# EasyEDA Pro project ht系统板.epro

# Schematic Schematic1
Board Name: Board1; Create Date: 2025-05-16; Page Name: P1; Project Name: ht系统板; Schematic Name: Schematic1; Update Date: 2025-05-16; Company: 嘉立创EDA; Page Size: A4; Version: V1.0
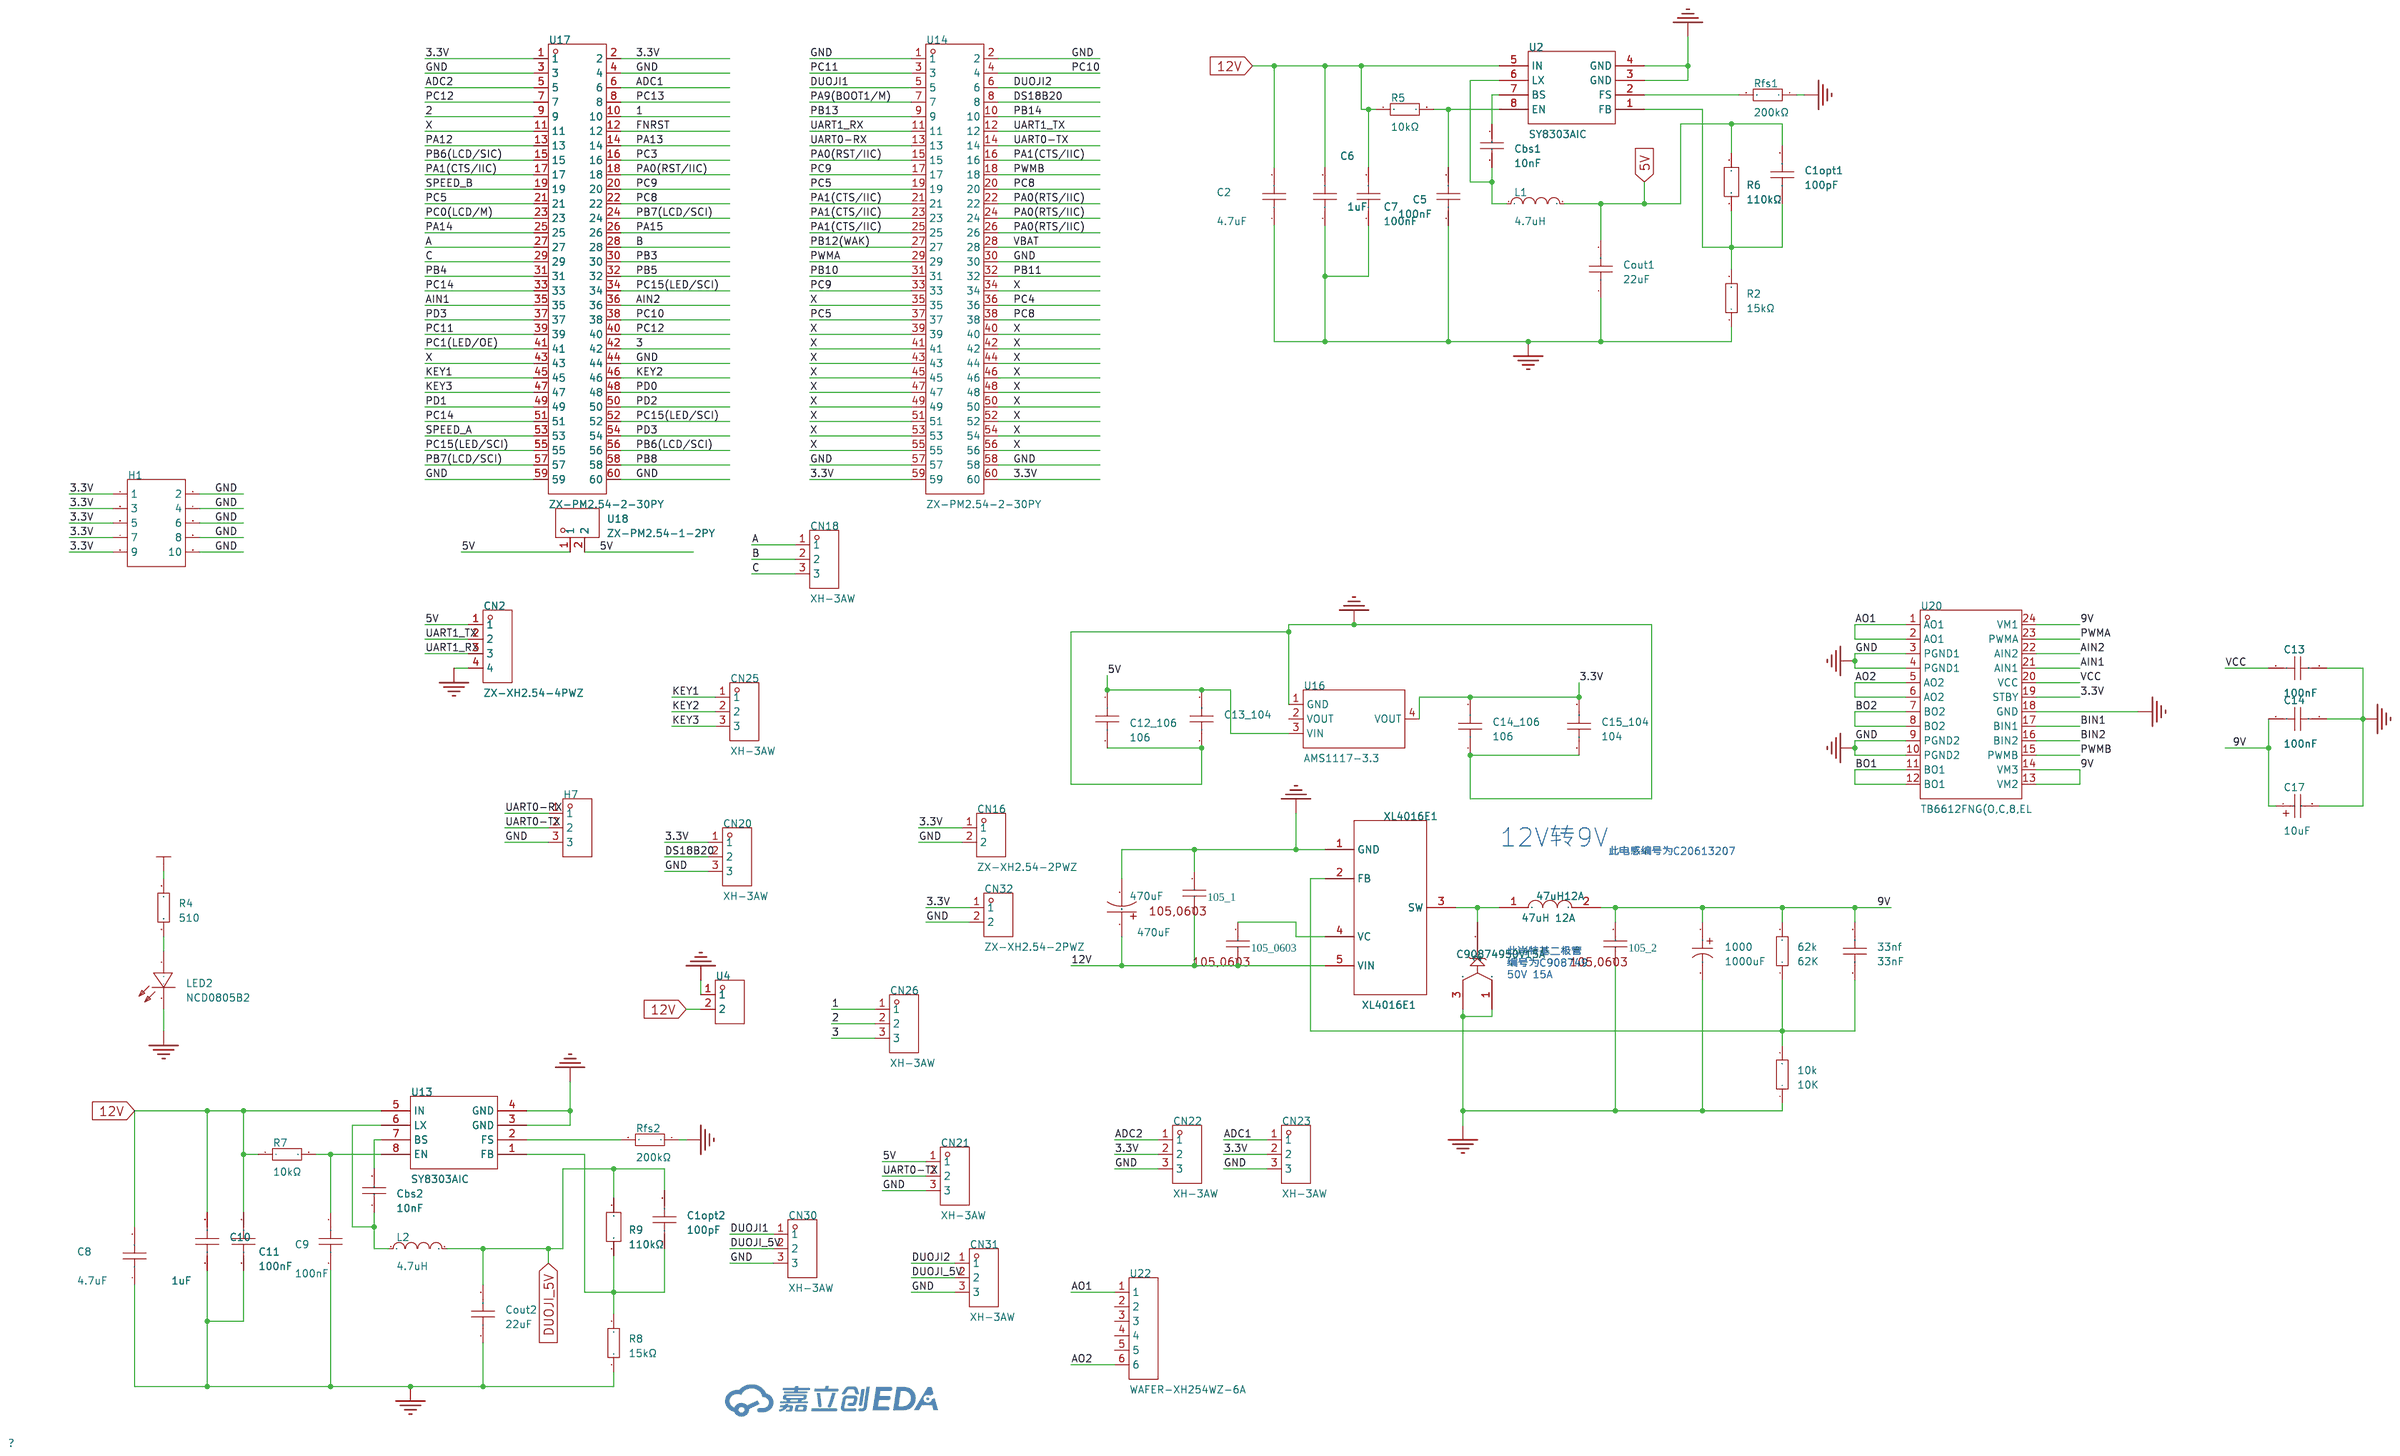
[diagram p0: schematic sheet]

## Parts
10k  10K  [r0805]
33nf  33nF  [C0603]
47uH12A  47uH 12A  [SMD,13.2x12.6mm]
62k  62K  [r0805]
105_1  105  [C0603]
105_2  105  [C0603]
105_0603  105  [C0603]
470uF  470uF  [CAP-SMD_BD12.5-L13.0-W13.0-RD]
1000  1000uF  [CAP-TH_BD10.0-P5.00-D1.0-FD]
C1opt1  100pF  [C0603]
C1opt2  100pF  [C0603]
C2  4.7uF  [C0402]
C5  100nF  [C0603]
C6  1uF  [C0603]
C7  100nF  [C0603]
C8  4.7uF  [C0402]
C9  100nF  [C0603]
C10  1uF  [C0603]
C11  100nF  [C0603]
C12_106  106  [C0603]
C13  100nF  [C0603]
C13_104  104  [C0603]
C14  100nF  [C0603]
C14_106  106  [C0603]
C15_104  104  [C0603]
C17  10uF  [CAP-SMD_L3.2-W1.6-RD-C7171]
C90874950V15A  -  [SL1550 50V 15A]
Cbs1  10nF  [C0603]
Cbs2  10nF  [C0603]
CN2  ZX-XH2.54-4PWZ  [CONN-TH_4P-P2.50_ZX-XH2.54-4PWZ]
CN16  ZX-XH2.54-2PWZ  [CONN-TH_2P-P2.50_ZX-XH2.54-2PWZ]
CN18  XH-3AW  [CONN-TH_3P-P2.54_HCTL_XH-3AW]
CN20  XH-3AW  [CONN-TH_3P-P2.54_HCTL_XH-3AW]
CN21  XH-3AW  [CONN-TH_3P-P2.54_HCTL_XH-3AW]
CN22  XH-3AW  [CONN-TH_3P-P2.54_HCTL_XH-3AW]
CN23  XH-3AW  [CONN-TH_3P-P2.54_HCTL_XH-3AW]
CN25  XH-3AW  [CONN-TH_3P-P2.54_HCTL_XH-3AW]
CN26  XH-3AW  [CONN-TH_3P-P2.54_HCTL_XH-3AW]
CN30  XH-3AW  [CONN-TH_3P-P2.54_HCTL_XH-3AW]
CN31  XH-3AW  [CONN-TH_3P-P2.54_HCTL_XH-3AW]
CN32  ZX-XH2.54-2PWZ  [CONN-TH_2P-P2.50_ZX-XH2.54-2PWZ]
Cout1  22uF  [C0805]
Cout2  22uF  [C0805]
H1  -  [HDR-TH_10P-P2.54-V-F-R2-C5-S2.54]
H7  -  [HDR-TH_3P-P2.54-V-M]
L1  4.7uH  [IND-SMD_L5.4-W5.2_FXL0530]
L2  4.7uH  [IND-SMD_L5.4-W5.2_FXL0530]
LED2  NCD0805B2  [LED0805-R-RD]
R2  15kΩ  [R0603]
R4  510  [R0603]
R5  10kΩ  [R0603]
R6  110kΩ  [R0603]
R7  10kΩ  [R0603]
R8  15kΩ  [R0603]
R9  110kΩ  [R0603]
Rfs1  200kΩ  [R0603]
Rfs2  200kΩ  [R0603]
U2  SY8303AIC  [TSOT-23-8_L2.9-W1.6-P0.65-LS2.8-BR]
U4  KF301-5.0-2P  [CONN-TH_P5.00_KF301-5.0-2P]
U13  SY8303AIC  [TSOT-23-8_L2.9-W1.6-P0.65-LS2.8-BR]
U14  ZX-PM2.54-2-30PY  [HDR-TH_60P-P2.54-V-F-R2-C30-S2.54]
U16  AMS1117-3.3  [SOT-223-3_L6.5-W3.4-P2.30-LS7.0-BR]
U17  ZX-PM2.54-2-30PY  [HDR-TH_60P-P2.54-V-F-R2-C30-S2.54]
U18  ZX-PM2.54-1-2PY  [HDR-TH_2P-P2.54-V-F]
U20  TB6612FNG(O,C,8,EL  [SSOP-24_L8.4-W5.8-P0.65-LS7.8-BL]
U22  WAFER-XH254WZ-6A  [CONN-TH_6P-P2.50_WAFER-XH254WZ-6A]
XL4016E1  XL4016E1  [TO-220-5L_L10.2-W4.5-P1.71-L]

## Library data of the parts
10k 62k R4 = Res_0603: Supplier Footprint: 0603
33nf C12_106 C13 C13_104 C14 C14_106 C15_104 = CAP_0603: Supplier Footprint: 0603
47uH12A = SMD,13.2x12.6mm
105_1 105_2 105_0603 = 105: Published: 8-Jun-2000; LatestRevisionDate: 17-Jul-2002; LatestRevisionNote: Re-released for DXP Platform.; Publisher: Altium Limited; Comment: 105,0603; Supplier: LCSC; Manufacturer: YAGEO; Manufacturer Part: CC0603KRX7R9BB104; Supplier Part: C14663
470uF = RVT1H471M1213: 容值:470uF;精度:±20%;额定电压:50V;纹波电流:530mA@120Hz;等效串联电阻:-;; LCSC Part Name: 470uF ±20% 50V; Supplier Part: C90272; Manufacturer: ROQANG(容强); Supplier Footprint: SMD,D12.5xL13.5mm; Datasheet: https://atta.szlcsc.com/upload/public/pdf/source/20220809/CF99377A6EA3F4895B6230BA7EE6A383.pdf; Supplier: LCSC; Tolerance: ±20%; Rated Voltage: 50V; Ripple Current: 530mA@120Hz; φD: 12.5mm; L: 13.5mm; Lifetime @ Temp: 2000hrs@105℃; Operating Temperature: -40℃~+105℃
1000 = SPE1EM102G12OL: 容值:1000uF;精度:±20%;额定电压:25V;纹波电流:-;等效串联电阻:-;类型:-;; LCSC Part Name: 1000uF ±20% 25V; Supplier Part: C697713; Manufacturer: Yunxing(云星); Supplier Footprint: 插件,D10xL12mm; JLCPCB Part Class: 扩展库; Datasheet: https://atta.szlcsc.com/upload/public/pdf/source/20200729/C697708_049AB0761557015E7F0CEB2EDBAAE750.pdf; Supplier: LCSC; Tolerance: ±20%; Rated Voltage: 25V; Lead Spacing: 5mm; φD: 10mm; L: 12mm; Lifetime @ Temp: 5000hrs@105℃; Operating Temperature: -55℃~+105℃
C1opt1 C1opt2 = CC0603JRNPO9BN101: 容值:100pF;精度:±5%;额定电压:50V;材质(温度系数):NP0;; LCSC Part Name: 100pF ±5% 50V; Supplier Part: C14665; Manufacturer: YAGEO(国巨); Supplier Footprint: 0603; JLCPCB Part Class: 扩展库; Datasheet: https://atta.szlcsc.com/upload/public/pdf/source/20181008/C309499_21CC21451B82C39E3D92150FD6B30293.pdf; Supplier: LCSC; Tolerance: ±5%; Voltage Rated: 50V; Temperature Coefficient: NP0
C2 C8 = CL05A475MQ5NRNC: 容值:4.7uF;精度:±20%;额定电压:6.3V;材质(温度系数):X5R;; LCSC Part Name: 4.7uF ±20% 6.3V; Supplier Part: C307423; Manufacturer: SAMSUNG(三星); Supplier Footprint: 0402; JLCPCB Part Class: 扩展库; Datasheet: https://atta.szlcsc.com/upload/public/pdf/source/20181010/C307423_0E0C4E35F3A09F81C2E5C84E00499E42.pdf; Supplier: LCSC; Tolerance: ±20%; Voltage Rated: 6.3V; Temperature Coefficient: X5R
C5 C7 C9 C11 = CGA0603X7R104K500JT: 容值:100nF;精度:±10%;额定电压:50V;材质(温度系数):X7R;; LCSC Part Name: 100nF ±10% 50V; Supplier Part: C6119867; Manufacturer: HRE(芯声); Supplier Footprint: 0603; JLCPCB Part Class: 扩展库; Supplier: LCSC; Tolerance: ±10%; Voltage Rated: 50V; Temperature Coefficient: X7R
C6 C10 = CGA0603X5R105K160JT: 容值:1uF;精度:±10%;额定电压:16V;材质(温度系数):X5R;; LCSC Part Name: 1uF ±10% 16V; Supplier Part: C6119849; Manufacturer: HRE(芯声); Supplier Footprint: 0603; JLCPCB Part Class: 扩展库; Supplier: LCSC; Tolerance: ±10%; Voltage Rated: 16V; Temperature Coefficient: X5R
C17 = TAJA106K016RNJ: 容值:10uF;精度:±10%;额定电压:16V;等效串联电阻(ESR):3Ω@100kHz;; LCSC Part Name: 10uF ±10% 16V; Supplier Part: C7171; Manufacturer: Kyocera AVX; Supplier Footprint: CASE-A-3216-18(mm); JLCPCB Part Class: 基础库; Supplier: LCSC; Tolerance: ±10%; Voltage Rating: 16V; Equivalent Series Resistance(ESR): 3Ω@100kHz; Operating Temperature: -55℃~+125℃
C90874950V15A = SL1550 50V 15A: 50V 15A; Supplier Part: C908749
Cbs1 Cbs2 = CC0603KRX7R9BB103: 容值:10nF;精度:±10%;额定电压:50V;材质(温度系数):X7R;; LCSC Part Name: 10nF ±10% 50V; Supplier Part: C100042; Manufacturer: YAGEO(国巨); Supplier Footprint: 0603; JLCPCB Part Class: 扩展库; Datasheet: https://atta.szlcsc.com/upload/public/pdf/source/20181008/C309510_22F155564471FAF6A489F7D68F34234E.pdf; Supplier: LCSC; Tolerance: ±10%; Voltage Rated: 50V; Temperature Coefficient: X7R
CN2 = ZX-XH2.54-4PWZ: 插针结构:1x4P;间距:2.5mm;安装方式:弯插;参考系列:XH;总PIN数:4P;排数:1;每排PIN数:4;行距:-;额定电流:3A;触头材质:黄铜;触头镀层:锡;工作温度范围:-25℃~+85℃;; LCSC Part Name: 1x4P 间距:2.5mm 弯插 系列:XH; Supplier Part: C7429643; Manufacturer: Megastar(兆星); Supplier Footprint: 弯插,P=2.5mm; JLCPCB Part Class: 扩展库; Datasheet: https://atta.szlcsc.com/upload/public/pdf/source/20230619/8DC602C7BA46C153FF1BE89D90453879.pdf; Supplier: LCSC; Pins Structure: 1x4P; Pitch: 2.5mm; Mounting Type: 弯插; Reference Series: XH; Number of Pins: 4P; Number of Rows: 1; Number of PINs Per Row: 4; Rated Current: 3A; Contact Material: 黄铜; Contact Plating: 锡; Operating Temperature: -25℃~+85℃; Rated Voltage (Max): 250V; Plastic Material: PA66; Flame Retardant Rating: UL94V-0; Color: 白色; Z-Height of the Board: 5.9mm; X-Length of Bottom Edge on Board (Spacing Line): 12.5mm; Y-Width of Bottom Edge on Board: 7.32mm
CN16 CN32 = ZX-XH2.54-2PWZ: 插针结构:1x2P;间距:2.5mm;安装方式:弯插;参考系列:XH;总PIN数:2P;排数:1;每排PIN数:2;行距:-;额定电流:3A;触头材质:黄铜;触头镀层:锡;工作温度范围:-25℃~+85℃;; LCSC Part Name: 1x2P 间距:2.5mm 弯插 系列:XH; Supplier Part: C7429641; Manufacturer: Megastar(兆星); Supplier Footprint: 弯插,P=2.5mm; JLCPCB Part Class: 扩展库; Datasheet: https://atta.szlcsc.com/upload/public/pdf/source/20230619/56AE8F2E01CDFEAA97FC89B5ED558AB5.pdf; Supplier: LCSC; Pins Structure: 1x2P; Pitch: 2.5mm; Mounting Type: 弯插; Reference Series: XH; Number of Pins: 2P; Number of Rows: 1; Number of PINs Per Row: 2; Rated Current: 3A; Contact Material: 黄铜; Contact Plating: 锡; Operating Temperature: -25℃~+85℃; Rated Voltage (Max): 250V; Plastic Material: PA66; Flame Retardant Rating: UL94V-0; Color: 白色; Z-Height of the Board: 5.9mm; X-Length of Bottom Edge on Board (Spacing Line): 7.5mm; Y-Width of Bottom Edge on Board: 7.32mm
CN18 CN20-CN23 CN25 CN26 CN30 CN31 = XH-3AW_C2908612: 插针结构:1x3P;间距:2.54mm;安装方式:弯插;参考系列:XH;总PIN数:3P;排数:1;每排PIN数:3;行距:-;额定电流:3A;触头材质:黄铜;触头镀层:锡;工作温度范围:-25℃~+85℃;; LCSC Part Name: 1x3P 间距:2.54mm 弯插 系列:XH; Supplier Part: C2908612; Manufacturer: HCTL(华灿天禄); Supplier Footprint: 弯插,P=2.5mm; JLCPCB Part Class: 扩展库; Datasheet: https://atta.szlcsc.com/upload/public/pdf/source/20230711/B565BAF3B11666EF6B81B3605408F2BD.pdf; Supplier: LCSC; Pins Structure: 1x3P; Pitch: 2.54mm; Mounting Style: 弯插; Reference Series: XH; Number of Pins: 3P; Number of Rows: 1; Number of PINs Per Row: 3; Current Rating (Max): 3A; Contact Material: 黄铜; Contact Plating: 锡; Operating Temperature Range: -25℃~+85℃
Cout1 Cout2 = CGA0805X5R226M350MT: 容值:22uF;精度:±20%;额定电压:35V;材质(温度系数):X5R;; LCSC Part Name: 22uF ±20% 35V; Supplier Part: C6119901; Manufacturer: HRE(芯声); Supplier Footprint: 0805; JLCPCB Part Class: 扩展库; Datasheet: https://atta.szlcsc.com/upload/public/pdf/source/20231129/D589D0CC4D260F7AC3A77E53B455CCB3.pdf; Supplier: LCSC; Tolerance: ±20%; Voltage Rated: 35V; Temperature Coefficient: X5R
H1 = HDR-F_2.54_2x5: Supplier Part: C92270; Supplier Footprint: 插件
H7 = HDR-M_2.54_1x3P: Supplier Part: C2937625; Supplier Footprint: 插件
L1 L2 = FXL0530-4R7-M: 电感值:4.7uH;精度:±20%;额定电流:4.5A;饱和电流(Isat):5A;类型:一体成型电感;; LCSC Part Name: 4.7uH ±20% 5A; Supplier Part: C177246; Manufacturer: cjiang(长江微电); Supplier Footprint: SMD,5.2x5.4mm; JLCPCB Part Class: 扩展库; Datasheet: https://atta.szlcsc.com/upload/public/pdf/source/20240426/3189EA8206330E2108542F9E34E540E7.pdf; Supplier: LCSC; Tolerance: ±20%; Rated Current: 4.5A; Saturation Current (Isat): 5A; DC Resistance (DCR): 60mΩ; Type: 一体成型电感
LED2 = NCD0805B2: 发光颜色:蓝色;正向电压(VF):2.5V~3.6V;功率:72mW;正向电流:2mA;主波长:468nm~478nm;透镜颜色:无色透明透镜;发光强度:20mcd~55mcd;发光角度:130°;工作温度:-30℃~+85℃;; Supplier Part: C84259; Manufacturer: 国星光电; Supplier Footprint: 0805; JLCPCB Part Class: 扩展库; Datasheet: https://atta.szlcsc.com/upload/public/pdf/source/20200820/C84259_E5AC6865415989C4C2C2831134BA3A23.pdf; Supplier: LCSC; Emitted Color: 蓝色; Forward Voltage (VF): 2.5V~3.6V; Power Dissipation: 72mW; Forward Current: 2mA; Dominant Wavelength: 468nm~478nm; Lens Color: 无色透明透镜; Luminous Intensity: 20mcd~55mcd; Viewing Angle: 130°; Operating Temperature: -30℃~+85℃
R2 R8 = 0603WAF1502T5E: 电阻类型:厚膜电阻;阻值:15kΩ;精度:±1%;功率:100mW;最大工作电压:75V;温度系数:±100ppm/℃;; LCSC Part Name: 15kΩ ±1% 100mW 厚膜电阻; Supplier Part: C22809; Manufacturer: UNI-ROYAL(厚声); Supplier Footprint: 0603; JLCPCB Part Class: 基础库; Datasheet: https://atta.szlcsc.com/upload/public/pdf/source/20200306/C422600_1E6D84923E4A46A82E41ADD87F860B5C.pdf; Supplier: LCSC; Type: 厚膜电阻; Tolerance: ±1%; Power(Watts): 100mW; Overload Voltage (Max): 75V; Temperature Coefficient: ±100ppm/℃; Operating Temperature Range: -55℃~+155℃
R5 R7 = 0603WAF1002T5E: 电阻类型:厚膜电阻;阻值:10kΩ;精度:±1%;功率:100mW;最大工作电压:75V;温度系数:±100ppm/℃;; LCSC Part Name: 厚膜电阻 10kΩ ±1% 100mW; Supplier Part: C25804; Manufacturer: UNI-ROYAL(厚声); Supplier Footprint: 0603; JLCPCB Part Class: 基础库; Datasheet: https://atta.szlcsc.com/upload/public/pdf/source/20200306/C422600_1E6D84923E4A46A82E41ADD87F860B5C.pdf; Supplier: LCSC; Type: 厚膜电阻; Tolerance: ±1%; Power(Watts): 100mW; Overload Voltage (Max): 75V; Temperature Coefficient: ±100ppm/℃; Operating Temperature Range: -55℃~+155℃
R6 R9 = FRC0603F1103TS: 电阻类型:厚膜电阻;阻值:110kΩ;精度:±1%;功率:100mW;最大工作电压:75V;温度系数:±100ppm/℃;; LCSC Part Name: 110kΩ ±1% 100mW 厚膜电阻; Supplier Part: C2906984; Manufacturer: FOJAN(富捷); Supplier Footprint: 0603; JLCPCB Part Class: 扩展库; Datasheet: https://atta.szlcsc.com/upload/public/pdf/source/20211221/925EC7D7225764EE0046F22065062C87.pdf; Supplier: LCSC; Type: 厚膜电阻; Tolerance: ±1%; Power(Watts): 100mW; Overload Voltage (Max): 75V; Temperature Coefficient: ±100ppm/℃; Operating Temperature Range: -55℃~+155℃
Rfs1 Rfs2 = 0603WAF2003T5E: 电阻类型:厚膜电阻;阻值:200kΩ;精度:±1%;功率:100mW;最大工作电压:75V;温度系数:±100ppm/℃;; LCSC Part Name: 200kΩ ±1% 100mW 厚膜电阻; Supplier Part: C25811; Manufacturer: UNI-ROYAL(厚声); Supplier Footprint: 0603; JLCPCB Part Class: 基础库; Datasheet: https://atta.szlcsc.com/upload/public/pdf/source/20200306/C422600_1E6D84923E4A46A82E41ADD87F860B5C.pdf; Supplier: LCSC; Type: 厚膜电阻; Tolerance: ±1%; Power(Watts): 100mW; Overload Voltage (Max): 75V; Temperature Coefficient: ±100ppm/℃; Operating Temperature Range: -55℃~+155℃
U2 U13 = SY8303AIC: 功能类型:降压型;输入电压:-;输出电流(最大值):-;; Supplier Part: C97054; Manufacturer: silergy(矽力杰); Supplier Footprint: TSOT-23-8; JLCPCB Part Class: 扩展库; Datasheet: https://atta.szlcsc.com/upload/public/pdf/source/20170308/1488958431714.pdf; Supplier: LCSC; Function: 降压型; Switch tube (built-in/external): 内置
U4 = KF301-5.0-2P: 结构:1x2P;间距:5mm;颜色:蓝色;安装方式:直插;额定电流:17A;额定电压:250V;排数:1;线规 - AWG:14~22;线规 - 平方毫米:1.5;每排PIN数:2;工作温度范围:-30℃~+120℃;; LCSC Part Name: 5mm 1x2P 排数:1 每排P数:2 直插; Supplier Part: C474881; Manufacturer: KEFA(科发); Supplier Footprint: 插件,P=5mm; JLCPCB Part Class: 扩展库; Datasheet: https://atta.szlcsc.com/upload/public/pdf/source/20230317/03A5B5FC229D6F9225E8F51DA1A4E80A.pdf; Supplier: LCSC; Structure: 1x2P; Pitch: 5mm; Color: 蓝色; Mounting Style: 直插; Current Rating (Max): 17A; Voltage Rating (Max): 250V; Number of Pins: 2P; Number of Rows: 1; Wire Gauge - AWG: 14~22; Wire Gauge - mm2: 1.5; Number of PINs Per Row: 2; Operating Temperature Range: -30℃~+120℃
U14 U17 = ZX-PM2.54-2-30PY: 插孔结构:2x30P;间距:2.54mm;行距:2.54mm;圆孔/方孔:方孔;安装类型:直插;排数:双排;总孔位数:60P;额定电流:-;额定电压:1kV;插孔方向:顶部;塑高:8.5mm;触头材质:-;触头镀层:金;工作温度范围:-40℃~+105℃;焊接温度(最大值):260℃@5S;; LCSC Part Name: 2x30P 间距:2.54mm 直插; Supplier Part: C7499356; Manufacturer: Megastar(兆星); Supplier Footprint: 插件,P=2.54mm; JLCPCB Part Class: 扩展库; Datasheet: https://atta.szlcsc.com/upload/public/pdf/source/20231122/23E1107B34356833C267F6B6E856DE02.pdf; Supplier: LCSC; Holes Structure: 2x30P; Pitch: 2.54mm; Row Spacing: 2.54mm; Circular Hole / Square Hole: 方孔; Mounting Type: 直插; Number of Rows: 双排; Number of Holes: 60P; Voltage Rating (Max): 1kV; Holes Direction: 顶部; Insulation Height: 8.5mm; Contact Plating: 金; Operating Temperature Range: -40℃~+105℃; Soldering Temperature(Max): 260℃@5S
U16 = AMS1117-3.3_C6186: 输出类型:固定;工作电压:-;输出电压:3.3V;输出电流:1A;电源纹波抑制比(PSRR):72dB@(120Hz);输出极性:正极;; LCSC Part Name: 输出3.3V 1A; Supplier Part: C6186; Manufacturer: AMS; Supplier Footprint: SOT-223; JLCPCB Part Class: 基础库; Datasheet: https://atta.szlcsc.com/upload/public/pdf/source/20180727/C6186_7A095716F0823C02F1997A905E26C086.pdf; Supplier: LCSC; Output Type: 固定; Output Voltage: 3.3V; Output Current: 1A; Power Supply Rejection Ratio (PSRR): 72dB@(120Hz); Voltage Dropout: 1.3V@(800mA); Features: 过流保护(OCP)；热关断(TSD); Output Configuration: 正极; Number of Outputs: 1
U18 = ZX-PM2.54-1-2PY: 插孔结构:1x2P;间距:2.54mm;行距:-;圆孔/方孔:方孔;安装类型:直插;排数:单排;总孔位数:2P;额定电流:-;额定电压:1kV;插孔方向:顶部;塑高:8.5mm;触头材质:-;触头镀层:金;工作温度范围:-40℃~+105℃;焊接温度(最大值):260℃@5S;; LCSC Part Name: 1x2P 间距:2.54mm 直插; Supplier Part: C7499322; Manufacturer: Megastar(兆星); Supplier Footprint: 插件,P=2.54mm; JLCPCB Part Class: 扩展库; Datasheet: https://atta.szlcsc.com/upload/public/pdf/source/20231122/F22175ABE3DCBFEB9E36A2E7DA44623C.pdf; Supplier: LCSC; Holes Structure: 1x2P; Pitch: 2.54mm; Circular Hole / Square Hole: 方孔; Mounting Type: 直插; Number of Rows: 单排; Number of Holes: 2P; Voltage Rating (Max): 1kV; Holes Direction: 顶部; Insulation Height: 8.5mm; Contact Plating: 金; Operating Temperature Range: -40℃~+105℃; Soldering Temperature(Max): 260℃@5S
U20 = TB6612FNG(O,C,8,EL: 双直流电机驱动器集成电路; Supplier Part: C88224; Manufacturer: TOSHIBA(东芝); Supplier Footprint: SSOP-24-208mil; JLCPCB Part Class: 扩展库; Datasheet: https://atta.szlcsc.com/upload/public/pdf/source/20171128/C141517_15118625624231147036.pdf; Supplier: LCSC
U22 = WAFER-XH254WZ-6A: 插针结构:1x6P;间距:2.54mm;安装方式:弯插;参考系列:XH;总PIN数:6P;排数:1;每排PIN数:6;额定电流:3A;触头材质:黄铜;工作温度:-25℃~+85℃;; LCSC Part Name: 1x6P 间距:2.54mm 弯插 系列:XH; Supplier Part: C7432695; Manufacturer: HANBO(汉博); Supplier Footprint: 插件,P=2.5mm; JLCPCB Part Class: 扩展库; Datasheet: https://atta.szlcsc.com/upload/public/pdf/source/20230721/127D646758C1D4B76FEF9901992220E1.pdf; Supplier: LCSC; Pins Structure: 1x6P; Pitch: 2.54mm; Mounting Type: 弯插; Reference Series: XH; Number of Pins: 6P; Number of Rows: 1; Number of PINs Per Row: 6; Current Rating: 3A; Contact Material: 黄铜; Operating Temperature: -25℃~+85℃; Voltage Rating: 250V; Plastic Material: PA66; Flame Retardant Rating: UL94V-0
XL4016E1 = XL4016E1: 功能类型:降压型;输入电压:8V~40V;输出电压:1.25V~36V;输出电流(最大值):8A;; Supplier Part: C55881; Manufacturer: XLSEMI(芯龙); Supplier Footprint: TO-220-5; Datasheet: https://atta.szlcsc.com/upload/public/pdf/source/20221017/BA256A5392B705775B4C335FAFB3EDCF.pdf; Supplier: LCSC; Function: 降压型; Input Voltage: 8V~40V; Output Voltage: 1.25V~36V; Output Current (Max): 8A; Switching Frequency: 180kHz; Synchronous Rectification: 否; Number of Outputs: 1; Topology: 降压式; Switch tube (built-in/external): 内置

## Nets
3.3V: C14_106.2 C15_104.2 CN16.1 CN20.1 CN22.2 CN23.2 CN32.1 H1.1 H1.3 H1.5 H1.7 H1.9 R4.1 U14.59 U14.60 U16.4(VOUT) U17.1 U17.2 U20.19(STBY)
5V: C1opt1.2 C12_106.1 C13_104.2 CN2.1 CN21.1 Cout1.2 L1.2 R6.2 U16.3(VIN) U18.1 U18.2
9V: 33nf.2 47uH12A.2 62k.2 105_2.2 1000.1 C14.1 C17.1 U20.13(VM2) U20.14(VM3) U20.24(VM1)
12V: 105_1.1 105_0603.1 470uF.1 C2.2 C6.2 C7.2 C8.2 C10.2 C11.2 R5.1 R7.1 U2.5(IN) U4.2 U13.5(IN) XL4016E1.5(VIN)
GND: 10k.1 105_1.2 105_2.1 470uF.2 1000.2 C2.1 C5.1 C6.1 C7.1 C8.1 C9.1 C10.1 C11.1 C12_106.2 C13.2 C13_104.1 C14.2 C14_106.1 C15_104.1 C17.2 C90874950V15A.1 C90874950V15A.3 CN2.4 CN16.2 CN20.3 CN21.3 CN22.3 CN23.3 CN30.3 CN31.3 CN32.2 Cout1.1 Cout2.1 H1.2 H1.4 H1.6 H1.8 H1.10 H7.3 LED2.2(-) R2.1 R8.1 Rfs1.1 Rfs2.1 U2.3(GND) U2.4(GND) U4.1 U13.3(GND) U13.4(GND) U14.1 U14.2 U14.30 U14.57 U14.58 U16.1(GND) U17.3 U17.4 U17.44 U17.59 U17.60 U20.3(PGND1) U20.4(PGND1) U20.9(PGND2) U20.10(PGND2) U20.18(GND) XL4016E1.1(GND)
VBAT: U14.28
VCC: C13.1 U20.20(VCC)
1: CN26.1 U17.10
2: CN26.2 U17.9
3: CN26.3 U17.42
A: CN18.1 U17.27
ADC1: CN23.1 U17.6
ADC2: CN22.1 U17.5
AIN1: U17.35 U20.21(AIN1)
AIN2: U17.36 U20.22(AIN2)
AO1: U20.1(AO1) U20.2(AO1) U22.1
AO2: U20.5(AO2) U20.6(AO2) U22.6
B: CN18.2 U17.28
BIN1: U20.17(BIN1)
BIN2: U20.16(BIN2)
BO1: U20.11(BO1) U20.12(BO1)
BO2: U20.7(BO2) U20.8(BO2)
C: CN18.3 U17.29
DS18B20: CN20.2 U14.8
DUOJI1: CN30.1 U14.5
DUOJI2: CN31.1 U14.6
DUOJI_5V: C1opt2.2 CN30.2 CN31.2 Cout2.2 L2.2 R9.2
FNRST: U17.12
KEY1: CN25.1 U17.45
KEY2: CN25.2 U17.46
KEY3: CN25.3 U17.47
PA0(RST/IIC): U14.15 U17.18
PA0(RTS/IIC): U14.22 U14.24 U14.26
PA1(CTS/IIC): U14.16 U14.21 U14.23 U14.25 U17.17
PA9(BOOT1/M): U14.7
PA12: U17.13
PA13: U17.14
PA14: U17.25
PA15: U17.26
PB3: U17.30
PB4: U17.31
PB5: U17.32
PB6(LCD/SCI): U17.56
PB6(LCD/SIC): U17.15
PB7(LCD/SCI): U17.24 U17.57
PB8: U17.58
PB10: U14.31
PB11: U14.32
PB12(WAK): U14.27
PB13: U14.9
PB14: U14.10
PC0(LCD/M): U17.23
PC1(LED/OE): U17.41
PC3: U17.16
PC4: U14.36
PC5: U14.19 U14.37 U17.21
PC8: U14.20 U14.38 U17.22
PC9: U14.17 U14.33 U17.20
PC10: U14.4 U17.38
PC11: U14.3 U17.39
PC12: U17.7 U17.40
PC13: U17.8
PC14: U17.33 U17.51
PC15(LED/SCI): U17.34 U17.52 U17.55
PD0: U17.48
PD1: U17.49
PD2: U17.50
PD3: U17.37 U17.54
PWMA: U14.29 U20.23(PWMA)
PWMB: U14.18 U20.15(PWMB)
SPEED_A: U17.53
SPEED_B: U17.19
UART0-RX: H7.1 U14.13
UART0-TX: CN21.2 H7.2 U14.14
UART1_RX: CN2.3 U14.11
UART1_TX: CN2.2 U14.12
X: U14.34 U14.35 U14.39 U14.40 U14.41 U14.42 U14.43 U14.44 U14.45 U14.46 U14.47 U14.48 U14.49 U14.50 U14.51 U14.52 U14.53 U14.54 U14.55 U14.56 U17.11 U17.43
$1N2977: LED2.1(+) R4.2
$1N10374: C1opt1.1 R2.2 R6.1 U2.1(FB)
$1N10379: Cbs1.1 L1.1 U2.6(LX)
$1N10381: C5.2 R5.2 U2.8(EN)
$1N10383: Cbs1.2 U2.7(BS)
$1N10384: Rfs1.2 U2.2(FS)
$1N11084: Rfs2.2 U13.2(FS)
$1N11085: C9.2 R7.2 U13.8(EN)
$1N11090: Cbs2.1 L2.1 U13.6(LX)
$1N11091: Cbs2.2 U13.7(BS)
$1N11095: C1opt2.1 R8.2 R9.1 U13.1(FB)
$1N43238: 105_0603.2 XL4016E1.4(VC)
$1N43241: 10k.2 33nf.1 62k.1 XL4016E1.2(FB)
$1N43244: 47uH12A.1 C90874950V15A.2 XL4016E1.3(SW)

Not connected (* = marked no-connect by the designer): U16 2(VOUT); U22 2 3 4 5

## Notes on the sheet
- 12V转9V
- 此电感编号为C20613207
- 此肖特基二极管
  编号为C908749
  50V 15A

# Schematic Schematic2
Company: 嘉立创EDA; Page Size: A4; Version: V1.0
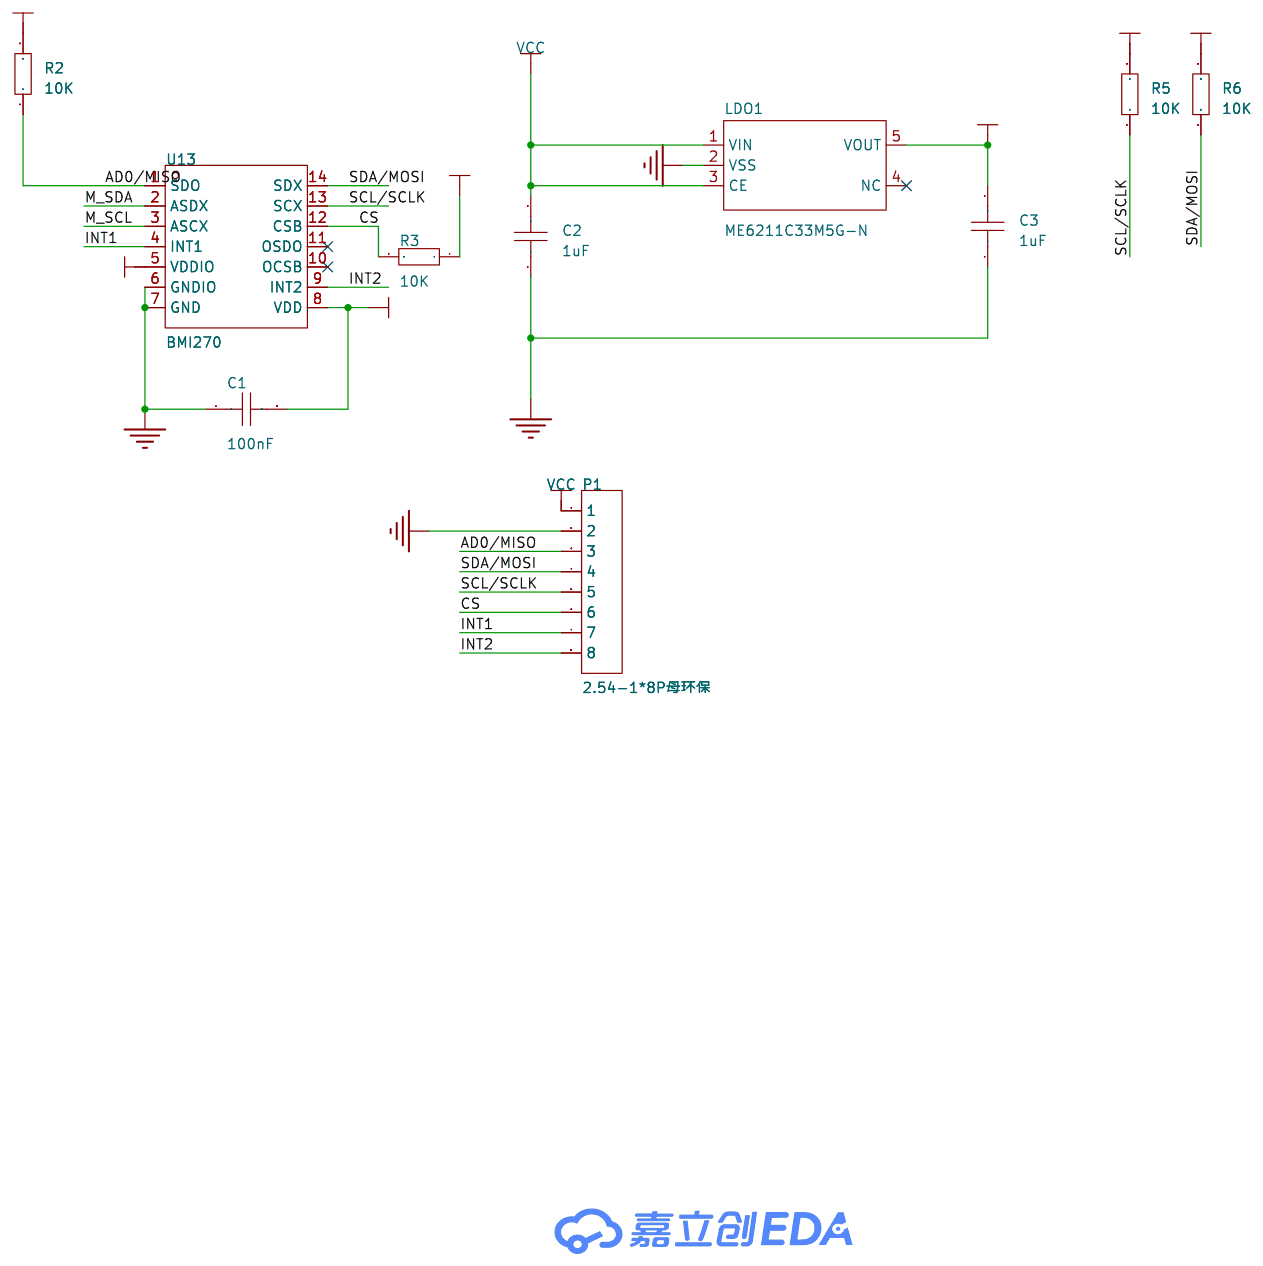
[diagram p1: schematic sheet]

## Parts
C1  100nF  [C0603]
C2  1uF  [C0603]
C3  1uF  [C0603]
LDO1  ME6211C33M5G-N  [SOT-23-5_L3.0-W1.7-P0.95-LS2.8-BL]
P1  2.54-1*8P母环保  [HDR-TH_8P-P2.54-V-F-1]
R2  10K  [R0603]
R3  10K  [R0603]
R5  10K  [R0603]
R6  10K  [R0603]
U13  BMI270  [LGA-14_L3.0-W2.5-P0.50-BR]

## Library data of the parts
C1-C3 = CAP_0603: Supplier Footprint: 0603
LDO1 = ME6211C33M5G-N: 输出类型:固定;工作电压:6V;输出电压:3.3V;输出电流:500mA;电源纹波抑制比(PSRR):70dB@(1kHz)；62dB@(10kHz);输出极性:正极;; LCSC Part Name: 输入6V 输出3.3V 500mA; Supplier Part: C82942; Manufacturer: MICRONE(南京微盟); Supplier Footprint: SOT-23-5; JLCPCB Part Class: 扩展库; Datasheet: https://atta.szlcsc.com/upload/public/pdf/source/20170918/C82942_1505727073070976520.pdf; Supplier: LCSC; Output Type: 固定; Voltage - Supply: 6V; Output Voltage: 3.3V; Output Current: 500mA; Power Supply Rejection Ratio (PSRR): 70dB@(1kHz)；62dB@(10kHz); Voltage Dropout: 260mV@(200mA); Features: 短路保护(SCP)；低ESR；过流保护(OCP)；带使能; Output Configuration: 正极; Number of Outputs: 1
P1 = 2.54-1*8P母环保: 插孔结构:1x8P;间距:2.54mm;行距:-;安装类型:直插;排数:单排;总孔位数:8P;塑高:-;触头材质:-;触头镀层:-;; LCSC Part Name: 间距:2.54mm 1x8P 直插; Supplier Part: C27438; Manufacturer: BOOMELE(博穆精密); Supplier Footprint: 插件,P=2.54mm; JLCPCB Part Class: 扩展库; Datasheet: https://atta.szlcsc.com/upload/public/pdf/source/20231221/1CA800C6799ED97958773716FAA1BFFE.pdf; Supplier: LCSC; Holes Structure: 1x8P; Pitch: 2.54mm; Mounting Type: 直插; Number of Rows: 单排; Number of Holes: 8P
R2 R3 R5 R6 = Res_0603: Supplier Footprint: 0603
U13 = BMI270: 传感器类型:加速度计陀螺仪;; Supplier Part: C2836813; Manufacturer: Bosch(博世); Supplier Footprint: LGA-14(2.5x3); JLCPCB Part Class: 扩展库; Datasheet: https://atta.szlcsc.com/upload/public/pdf/source/20210625/C2836813_35E1F3F92097F45A3828DF13DDBA01A5.pdf; Supplier: LCSC; Sensor Type: 加速度计陀螺仪; Operating Temperature: -40℃~+85℃

## Nets
3.3V: C1.2 C3.2 LDO1.5(VOUT) R2.2 R3.1 R5.1 R6.1 U13.5(VDDIO) U13.8(VDD)
GND: C1.1 C2.1 C3.1 LDO1.2(VSS) P1.2 U13.6(GNDIO) U13.7(GND)
VCC: C2.2 LDO1.1(VIN) LDO1.3(CE) P1.1
AD0/MISO: P1.3 R2.1 U13.1(SDO)
CS: P1.6 R3.2 U13.12(CSB)
INT1: P1.7 U13.4(INT1)
INT2: P1.8 U13.9(INT2)
M_SCL: U13.3(ASCX)
M_SDA: U13.2(ASDX)
SCL/SCLK: P1.5 R5.2 U13.13(SCX)
SDA/MOSI: P1.4 R6.2 U13.14(SDX)

Not connected (* = marked no-connect by the designer): LDO1 4(NC)*; U13 10(OCSB)* 11(OSDO)*

# Board PCB1
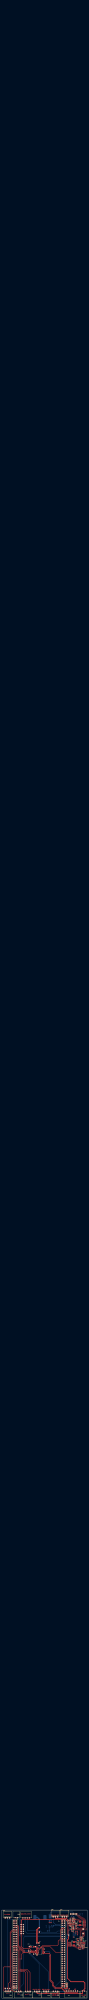
[diagram p2: board, top side]
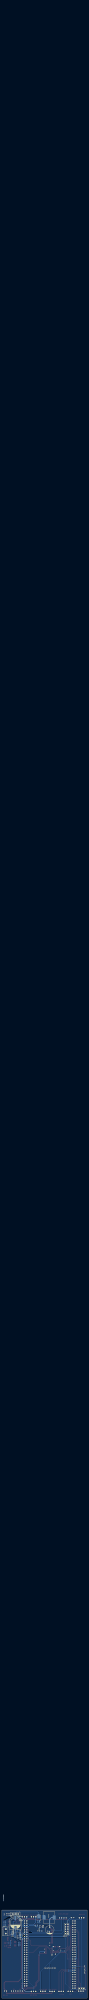
[diagram p3: board, bottom side, seen from below]

Outline 98 x 100 mm; copper layers: Top Layer, GND, 5V, Bottom Layer. Coordinates in mm from the lower left corner of the outline.
Outline path: rectangle 0,100 98,0
Stack: Top Layer 0.035mm 外层铜厚1oz / Dielectric1 0.2104mm 7628 RC49% 8.6mil / GND 0.0152mm 内层铜厚 / Dielectric2 1.065mm 1.1mm H/HOZ Copper / 5V 0.0152mm 内层铜厚 / Dielectric3 0.2104mm 7628 RC49% 8.6mil / Bottom Layer 0.035mm 外层铜厚1oz

## Design rules (mm)
template: JLCPCB Capability(Two Layers Board)
spacing copperThickness1oz (default): track to track 0.102, other pairs 0.152 to 0.3
spacing copperThickness2oz: track to track 0.203, other pairs 0.152 to 0.3
track width copperThickness1oz (default): min 0.127, default 0.254, max 2.54
track width copperThickness2oz: min 0.203, default 0.254, max 2.54
differential pair differentialPair (default): width min 0.127, default 0.254, max 2.54; gap min 0.152, default 0.152
via viaSize (default): diameter min 0.5, default 0.61, max 10; hole min 0.3, default 0.305, max 6.3

## Placement (name value [footprint] x y rotation side)
10k  10K  [r0805]  53.35 76.31 0 bottom
33nf  33nF  [C0603]  54.32 81.52 90 bottom
47uH12A  47uH 12A  [SMD,13.2x12.6mm]  43.72 91.62 180 bottom
62k  62K  [r0805]  58.32 82.47 180 bottom
105_1  105  [C0603]  92.23 95.17 270 bottom
105_2  105  [C0603]  50.96 81.47 90 bottom
105_0603  105  [C0603]  89.69 95.17 270 bottom
470uF  470uF  [CAP-SMD_BD12.5-L13.0-W13.0-RD]  82.33 84.89 90 bottom
1000  1000uF  [CAP-TH_BD10.0-P5.00-D1.0-FD]  43.09 77.65 270 bottom
C1opt1  100pF  [C0603]  94.47 59.17 270 top
C1opt2  100pF  [C0603]  77.56 87.38 90 top
C2  4.7uF  [C0402]  90.85 65.59 180 top
C5  100nF  [C0603]  90.03 59.72 180 top
C6  1uF  [C0603]  90.82 67.33 180 top
C7  100nF  [C0603]  90.86 69.14 180 top
C8  4.7uF  [C0402]  81.52 81.6 0 top
C9  100nF  [C0603]  82.16 87.23 0 top
C10  1uF  [C0603]  81.36 79.92 0 top
C11  100nF  [C0603]  81.36 77.92 0 top
C12_106  106  [C0603]  86.77 71.55 90 bottom
C13  100nF  [C0603]  31.66 53.39 180 top
C13_104  104  [C0603]  84.87 71.55 270 bottom
C14  100nF  [C0603]  41.05 62.66 0 top
C14_106  106  [C0603]  76.75 68.01 90 bottom
C15_104  104  [C0603]  76.74 75.24 270 bottom
C17  10uF  [CAP-SMD_L3.2-W1.6-RD-C7171]  34.96 58.47 0 top
C90874950V15A  -  [SL1550 50V 15A]  55.4 91.24 270 bottom
Cbs1  10nF  [C0603]  87.28 62.62 270 top
Cbs2  10nF  [C0603]  85.27 83.58 90 top
CN2  ZX-XH2.54-4PWZ  [CONN-TH_4P-P2.50_ZX-XH2.54-4PWZ]  27.97 91.11 180 top
CN16  ZX-XH2.54-2PWZ  [CONN-TH_2P-P2.50_ZX-XH2.54-2PWZ]  93.76 8.18 0 top
CN18  XH-3AW  [CONN-TH_3P-P2.54_HCTL_XH-3AW]  19.34 7.8 180 top
CN20  XH-3AW  [CONN-TH_3P-P2.54_HCTL_XH-3AW]  61.63 7.8 180 top
CN21  XH-3AW  [CONN-TH_3P-P2.54_HCTL_XH-3AW]  6.51 91.24 0 top
CN22  XH-3AW  [CONN-TH_3P-P2.54_HCTL_XH-3AW]  40.29 7.8 180 top
CN23  XH-3AW  [CONN-TH_3P-P2.54_HCTL_XH-3AW]  50.83 7.93 180 top
CN25  XH-3AW  [CONN-TH_3P-P2.54_HCTL_XH-3AW]  29.88 7.8 180 top
CN26  XH-3AW  [CONN-TH_3P-P2.54_HCTL_XH-3AW]  7.27 8.05 180 top
CN30  XH-3AW  [CONN-TH_3P-P2.54_HCTL_XH-3AW]  61.5 92.38 0 top
CN31  XH-3AW  [CONN-TH_3P-P2.54_HCTL_XH-3AW]  71.91 92.38 0 top
CN32  ZX-XH2.54-2PWZ  [CONN-TH_2P-P2.50_ZX-XH2.54-2PWZ]  16.67 91.36 180 top
Cout1  22uF  [C0805]  89.44 57.58 180 top
Cout2  22uF  [C0805]  82.46 89.22 0 top
H1  -  [HDR-TH_10P-P2.54-V-F-R2-C5-S2.54]  23.53 78.41 90 bottom
H7  -  [HDR-TH_3P-P2.54-V-M]  6.64 11.1 0 bottom
L1  4.7uH  [IND-SMD_L5.4-W5.2_FXL0530]  82.71 61.92 270 top
L2  4.7uH  [IND-SMD_L5.4-W5.2_FXL0530]  89.69 84.89 90 top
LED2  NCD0805B2  [LED0805-R-RD]  74.84 15.49 270 top
NOREF  -  [Pad_e1169]  31.53 58.47 0 top
NOREF#2  -  [Pad_e899]  40.42 49.07 0 top
NOREF#3  -  [Pad_e42]  36.61 50.09 0 top
NOREF#4  -  [Pad_e1381]  38.89 54.41 0 top
NOREF#5  -  [Pad_e1375]  31 54.65 0 top
NOREF#6  -  [Pad_e1214]  42.96 62.66 0 top
NOREF#7  -  [Pad_e2566]  76.56 71.68 0 top
NOREF#8  -  [Pad_e1213]  43.09 59.74 0 top
NOREF#9  -  [Pad_e1212]  49.05 51.87 0 top
NOREF#10  -  [Pad_e900]  38.77 58.47 0 top
NOREF#11  -  [Pad_e1210]  48.93 55.8 0 top
R2  15kΩ  [R0603]  95.12 62.67 270 top
R4  510  [R0603]  74.83 11.62 90 top
R5  10kΩ  [R0603]  86.85 66.48 270 top
R6  110kΩ  [R0603]  92.68 59.14 270 top
R7  10kΩ  [R0603]  85.43 80.02 90 top
R8  15kΩ  [R0603]  77.56 83.82 90 top
R9  110kΩ  [R0603]  79.15 87.44 90 top
Rfs1  200kΩ  [R0603]  93.59 62.67 270 top
Rfs2  200kΩ  [R0603]  79.03 83.82 90 top
U2  SY8303AIC  [TSOT-23-8_L2.9-W1.6-P0.65-LS2.8-BR]  90.71 62.54 0 top
U4  KF301-5.0-2P  [CONN-TH_P5.00_KF301-5.0-2P]  93.33 75.87 90 bottom
U13  SY8303AIC  [TSOT-23-8_L2.9-W1.6-P0.65-LS2.8-BR]  81.69 84.27 180 top
U14  ZX-PM2.54-2-30PY  [HDR-TH_60P-P2.54-V-F-R2-C30-S2.54]  70.52 50.85 270 top
U16  AMS1117-3.3  [SOT-223-3_L6.5-W3.4-P2.30-LS7.0-BR]  79.53 71.68 0 bottom
U17  ZX-PM2.54-2-30PY  [HDR-TH_60P-P2.54-V-F-R2-C30-S2.54]  15.27 50.85 270 top
U18  ZX-PM2.54-1-2PY  [HDR-TH_2P-P2.54-V-F]  15.27 11.48 0 top
U20  TB6612FNG(O,C,8,EL  [SSOP-24_L8.4-W5.8-P0.65-LS7.8-BL]  43.85 53.9 90 top
U22  WAFER-XH254WZ-6A  [CONN-TH_6P-P2.50_WAFER-XH254WZ-6A]  80.68 8.18 0 top
XL4016E1  XL4016E1  [TO-220-5L_L10.2-W4.5-P1.71-L]  82.33 95.56 0 bottom

## Footprints (pads in the part's own frame, mm; a bottom-side part is the same pattern mirrored in y, then rotated)
C0402
  rect 0.79x0.54 smd: 1(-0.545,0) 2(0.545,0)
C0603
  rect 0.8x0.9 smd: 1(-0.7,0) 2(0.7,0)
C0805
  rect 1.41x1.35 smd: 1(-1,0) 2(1,0)
CAP-SMD_BD12.5-L13.0-W13.0-RD
  rect 5x1.6 smd: 1(5.8,0) 2(-5.8,0)
CAP-SMD_L3.2-W1.6-RD-C7171
  rect 1.758x1.296 smd: 1(-1.687,0) 2(1.687,0)
CAP-TH_BD10.0-P5.00-D1.0-FD
  round 1.6 hole 1: 1(-2.54,0) 2(2.54,0)
CONN-TH_2P-P2.50_ZX-XH2.54-2PWZ
  rect 1.524x1.5 hole 0.9: 1(-1.25,0)
  round 1.5 hole 0.9: 2(1.25,0)
CONN-TH_3P-P2.54_HCTL_XH-3AW
  round 1.8 hole 1.199: 1(-2.54,0) 2(0.002,0) 3(2.54,0)
CONN-TH_4P-P2.50_ZX-XH2.54-4PWZ
  rect 1.524x1.5 hole 0.9: 1(-3.75,0)
  round 1.5 hole 0.9: 2(-1.25,0) 3(1.25,0) 4(3.75,0)
CONN-TH_6P-P2.50_WAFER-XH254WZ-6A
  rect 1.524x1.524 hole 0.914: 1(-6.25,0)
  round 1.524 hole 0.914: 2(-3.75,0) 3(-1.25,0) 4(1.25,0) 5(3.75,0) 6(6.25,0)
CONN-TH_P5.00_KF301-5.0-2P
  round 2.2 hole 1.4: 1(-2.5,0) 2(2.5,0)
HDR-TH_2P-P2.54-V-F
  rect 1.7x1.7 hole 1: 1(-1.27,0)
  round 1.7 hole 1: 2(1.27,0)
HDR-TH_3P-P2.54-V-M
  rect 1.7x1.7 hole 1.1: 1(-2.54,0)
  round 1.7 hole 1.1: 2(0,0) 3(2.54,0)
HDR-TH_10P-P2.54-V-F-R2-C5-S2.54
  rect 1.575x1.7 hole 1.1: 1(-5.08,-1.27)
  round 1.7 hole 1.1: 2(-5.08,1.27) 3(-2.54,-1.27) 4(-2.54,1.27) 5(0,-1.27) 6(0,1.27) 7(2.54,-1.27) 8(2.54,1.27) 9(5.08,-1.27) 10(5.08,1.27)
HDR-TH_60P-P2.54-V-F-R2-C30-S2.54
  rect 1.6x1.6 hole 1: 1(-36.83,-1.27)
  round 1.6 hole 1: 2(-36.83,1.27) 3(-34.29,-1.27) 4(-34.29,1.27) 5(-31.75,-1.27) 6(-31.75,1.27) 7(-29.21,-1.27) 8(-29.21,1.27) 9(-26.67,-1.27) 10(-26.67,1.27) 11(-24.13,-1.27) 12(-24.13,1.27) 13(-21.59,-1.27) 14(-21.59,1.27) 15(-19.05,-1.27) 16(-19.05,1.27) 17(-16.51,-1.27) 18(-16.51,1.27) 19(-13.97,-1.27) 20(-13.97,1.27) 21(-11.43,-1.27) 22(-11.43,1.27) 23(-8.89,-1.27) 24(-8.89,1.27) 25(-6.35,-1.27) 26(-6.35,1.27) 27(-3.81,-1.27) 28(-3.81,1.27) 29(-1.27,-1.27) 30(-1.27,1.27) 31(1.27,-1.27) 32(1.27,1.27) 33(3.81,-1.27) 34(3.81,1.27) 35(6.35,-1.27) 36(6.35,1.27) 37(8.89,-1.27) 38(8.89,1.27) 39(11.43,-1.27) 40(11.43,1.27) 41(13.97,-1.27) 42(13.97,1.27) 43(16.51,-1.27) 44(16.51,1.27) 45(19.05,-1.27) 46(19.05,1.27) 47(21.59,-1.27) 48(21.59,1.27) 49(24.13,-1.27) 50(24.13,1.27) 51(26.67,-1.27) 52(26.67,1.27) 53(29.21,-1.27) 54(29.21,1.27) 55(31.75,-1.27) 56(31.75,1.27) 57(34.29,-1.27) 58(34.29,1.27) 59(36.83,-1.27) 60(36.83,1.27)
IND-SMD_L5.4-W5.2_FXL0530
  rect 1.9x2.5 smd: 1(-2.05,0) 2(2.05,0)
LED0805-R-RD
  rect 1x1.399 smd: 1(1.05,0) 2(-1.05,0)
Pad_e42
  round 1.524 hole 0.914: 1(0,0)
Pad_e899
  round 1.524 hole 0.914: 1(0,0)
Pad_e900
  round 1.524 hole 0.914: 2(0,0)
Pad_e1169
  round 1.524 hole 0.914: 1(0,0)
Pad_e1210
  round 0.762 hole 0.635: 1(0,0)
Pad_e1212
  round 0.762 hole 0.635: 1(0,0)
Pad_e1213
  round 0.762 hole 0.635: 2(0,0)
Pad_e1214
  round 0.762 hole 0.635: 3(0,0)
Pad_e1375
  round 0.762 hole 0.635: 1(0,0)
Pad_e1381
  round 0.762 hole 0.635: 1(0,0)
Pad_e2566
  round 1.524 hole 0.914: 1(0,0)
R0603
  rect 0.806x0.864 smd: 1(-0.753,0) 2(0.753,0)
r0805
  rect 1.133x1.377 smd: 1(-1,0) 2(1,0)
SL1550 50V 15A
  rect 1.8x1.2 smd: 1(3.477,0.895) 3(3.477,-1.137)
  rect 4.6x3.15 smd: 2(-1.603,-0.12)
SMD,13.2x12.6mm
  rect 3.5x5 smd: 1(-5.75,0) 2(5.75,0)
SOT-223-3_L6.5-W3.4-P2.30-LS7.0-BR
  rect 2.5x1.1 smd: 1(2.97,-2.3) 2(2.97,0) 3(2.97,2.3)
  rect 2.34x3.6 smd: 4(-2.97,0)
SSOP-24_L8.4-W5.8-P0.65-LS7.8-BL
  oval 0.364x2.082 smd: 1(-3.575,-3.491) 2(-2.925,-3.491) 3(-2.275,-3.491) 4(-1.625,-3.491) 5(-0.975,-3.491) 6(-0.325,-3.491) 7(0.325,-3.491) 8(0.975,-3.491) 9(1.625,-3.491) 10(2.275,-3.491) 11(2.925,-3.491) 12(3.575,-3.491) 13(3.575,3.491) 14(2.925,3.491) 15(2.275,3.491) 16(1.625,3.491) 17(0.975,3.491) 18(0.325,3.491) 19(-0.325,3.491) 20(-0.975,3.491) 21(-1.625,3.491) 22(-2.275,3.491) 23(-2.925,3.491) 24(-3.575,3.491)
TO-220-5L_L10.2-W4.5-P1.71-L
  round 1.4 hole 1.1: 1(-3.42,0) 2(-1.71,0) 3(0,0) 4(1.71,0) 5(3.42,0)
TSOT-23-8_L2.9-W1.6-P0.65-LS2.8-BR
  oval 1.222x0.364 smd: 1(1.211,-0.975) 2(1.211,-0.325) 3(1.211,0.325) 4(1.211,0.975) 5(-1.211,0.975) 6(-1.211,0.325) 7(-1.211,-0.325) 8(-1.211,-0.975)

## Nets
As in the schematic, except:
3.3V: C14_106.2 C15_104.2 CN16.1 CN20.1 CN22.2 CN23.2 CN32.1 H1.1 H1.3 H1.5 H1.7 H1.9 NOREF#7.1 R4.1 U14.59 U14.60 U16.4 U17.1 U17.2 U20.19
9V: 33nf.2 47uH12A.2 62k.2 105_2.2 1000.1 C14.1 C17.2 NOREF#2.1 NOREF#10.2 U20.13 U20.14 U20.24
GND: 10k.1 105_1.2 105_2.1 470uF.2 1000.2 C2.1 C5.1 C6.1 C7.1 C8.1 C9.1 C10.1 C11.1 C12_106.2 C13.2 C13_104.1 C14.2 C14_106.1 C15_104.1 C17.1 C90874950V15A.1 C90874950V15A.3 CN2.4 CN16.2 CN20.3 CN21.3 CN22.3 CN23.3 CN30.3 CN31.3 CN32.2 Cout1.1 Cout2.1 H1.2 H1.4 H1.6 H1.8 H1.10 H7.3 LED2.2 NOREF.1 NOREF#3.1 NOREF#4.1 NOREF#5.1 NOREF#6.3 NOREF#8.2 NOREF#9.1 NOREF#11.1 R2.1 R8.1 Rfs1.1 Rfs2.1 U2.3 U2.4 U4.1 U13.3 U13.4 U14.1 U14.2 U14.30 U14.57 U14.58 U16.1 U17.3 U17.4 U17.44 U17.59 U17.60 U20.3 U20.4 U20.9 U20.10 U20.18 XL4016E1.1

Pads without a net: U16 2; U22 2 3 4 5

## Via types
v1: diameter 0.61, hole 0.305, Top Layer to Bottom Layer, 10 vias
v2: diameter 1.3, hole 0.8, Top Layer to Bottom Layer, 26 vias
v3: diameter 0.889, hole 0.635, Top Layer to Bottom Layer, 11 vias

## Routing (per net, layer and track width the routed paths; a pad name or vN(x,y) marks a point on that pad's centre or on a via; arc(x,y) is an arc through that point)
3.3V: length 353.5
  Top Layer w0.508: U20.19 34.58,53.57 32,56.15 24.92,56.15 22.24,58.83 22.24,73.29 arc(22.24,73.31) H1.1
  Top Layer w0.635: H1.7 H1.9 22.26,88.19 23.27,89.2 73.18,89.2 75.85,86.54 75.85,72.39 NOREF#7.1
  Top Layer w0.762: CN22.2 40.29,6.02 41.12,5.19 50.9,5.19 ; H1.1 H1.3 H1.5 H1.7 ; 50.9,5.19 91.94,5.19 92.51,5.77 CN16.1 arc(92.6,8.2) 92.68,8.25 95.28,10.85 95.28,17.32 93.88,18.71 79.27,18.71 75.32,22.66 75.32,66.12 76.56,67.36 NOREF#7.1 ; 50.9,5.19 50.9,7.76 arc(50.88,7.85) CN23.2 ; CN20.1 64.17,5.38
  Top Layer w1: 69.25,14.02 71.79,14.02 71.79,12.09 arc(71.85,11.76) 72.04,11.48 arc(72.73,11.02) 73.53,10.86 R4.1
  Bottom Layer w0.635: H1.9 22.26,88.19 19.08,91.36 CN32.1
  Bottom Layer w0.762: CN20.1 70.9,7.8 73.95,10.85 73.95,67.49 75.09,68.63 76.56,68.63 arc(76.66,68.65) C14_106.2
5V:
  vias: v2(77.12,62.86) v2(77.12,61.12) v2(77.12,59.49) v2(78.9,62.86) v2(78.9,61.09) v2(78.9,59.49) v2(82.5,69.38)
9V: length 47.4
  Top Layer w0.508: 40.42,50.17 NOREF#2.1
  Top Layer w1.016: NOREF#10.2 C17.2
  Top Layer w1.27: C14.1 40.35,77.62 42.81,80.07 arc(42.94,80.16) 1000.1
  Bottom Layer w0.508: 40.29,49.67 40.29,58.03 39.85,58.47 NOREF#10.2
  Bottom Layer w1.27: 1000.1 43.09,89.59 40.99,91.68 38.12,91.68 arc(38.04,91.66) 47uH12A.2
12V:
  vias: v2(93.63,85.86) v2(93.63,84.05) v2(93.63,82.22) v2(93.71,87.48) v2(95.54,87.43) v2(95.54,85.78) v2(95.51,83.95) v2(95.51,82.24)
GND: length 26.6
  Top Layer w0.381: v2(79.64,77.8) 80.36,77.8 arc(80.52,77.83) C11.1
  Top Layer w0.508: C14.2 NOREF#6.3 ; 41.75,59.74 NOREF#8.2 ; NOREF#4.1 39.14,54.41 arc(39.31,54.32) 39.5,54.29 40.28,54.29 arc(40.32,54.26) U20.18 ; NOREF#5.1 31,53.51 arc(30.99,53.45) C13.2
  Top Layer w0.6: C2.1 91.39,67.03 arc(91.43,67.19) C6.1 arc(91.55,67.37) 91.56,67.42 C7.1 ; R8.1 Rfs2.1
  Top Layer w1: U14.57 U14.58 74.78,16.56 arc(74.81,16.55) LED2.2
  Top Layer w1.016: C17.1 NOREF.1
  Bottom Layer w0.381: C15_104.1 76.97,76.17 v2(76.97,77.31) ; U16.1 82.05,74.43 v2(82.05,75.38) arc(82.27,75.29) 82.5,75.24 ; v2(84.87,74) C13_104.1
  Bottom Layer w0.508: 56.74,85.78 v2(56.42,85.78) ; v2(54.51,85.78) 54.51,87.63 arc(54.48,87.79) 54.39,87.94
  vias: v1(81.55,85.45) v1(81.55,83.17) v1(81.83,84.27) v1(90.58,63.63) v1(90.58,61.77) v1(90.85,62.77) v2(80.17,76.12) v2(85,75.93) v2(86.73,75.9) v2(86.77,72.38) v2(86.99,74.08)
VCC: length 8.2
  Top Layer w0.508: C13.1 33.29,53.39 arc(33.34,53.38) 33.39,53.35 33.81,52.92 U20.20
1: length 74.5
  Top Layer w0.381: U17.10 15.27,76.25 12.48,76.25 10.51,74.28 10.51,13 11.05,12.47 11.05,8.94 10.41,8.3 arc(10.13,8.12) CN26.1
2: length 73.3
  Top Layer w0.381: U17.9 12.22,77.52 9.56,74.85 9.56,18.59 7.84,16.88 7.84,9.89 7.27,9.32 CN26.2
3: length 44.2
  Top Layer w0.381: v3(8.41,35.55) 2.64,35.55 1.94,34.85 1.94,9.07 2.95,8.05 CN26.3
  Bottom Layer w0.381: U17.42 15.27,35.61 8.67,35.61
A: length 55
  Top Layer w0.381: U17.27 15.14,55.8 19.72,55.8 20.86,54.66 20.86,9.32 21.52,8.66 arc(21.78,8.27) CN18.1
ADC1: length 93.5
  Top Layer w0.381: v3(26.07,54.4) 24.93,54.4 19.34,60 19.34,81.71 18.45,82.6 U17.6
  Bottom Layer w0.381: v3(26.07,54.4) 29.12,54.4 53.24,30.27 53.24,8.24 arc(53.28,8.07) CN23.1
ADC2: length 90.7
  Top Layer w0.381: v3(26.07,53.3) 24.76,53.3 18.64,59.42 18.64,80.63 17.94,81.33 15.27,81.33 U17.5
  Bottom Layer w0.381: CN22.1 42.83,39.29 28.86,53.26 26.16,53.26 arc(26.11,53.27) v3(26.07,53.3)
AIN1: length 46.5
  Top Layer w0.381: 11.97,58.34 18.35,58.34 24.42,52.27 25.93,52.27 arc(26.07,52.26) 26.21,52.27 U20.21
  Bottom Layer w0.381: v3(11.97,58.42) 11.97,45.14 12.61,44.5 U17.35
AIN2: length 29.8
  Top Layer w0.381: U20.22 24.29,51.62 22.31,49.65 v3(22.31,44.5)
  Bottom Layer w0.381: U17.36 22.38,44.5
AO1: length 63.2
  Top Layer w0.508: U20.2 54.13,50.97 56.16,48.94 56.16,20.62 58.9,17.89 58.9,14.85 61.53,12.21 68.64,12.21 72.69,8.16 74.39,8.16 arc(74.41,8.17) U22.1
AO2: length 80.5
  Top Layer w0.508: U20.5 v3(49.05,52.92) ; U22.6 86.93,7.06 86.52,6.66 73.06,6.66 68.46,11.25 60.99,11.25 57.96,14.29 57.96,17.32 55.16,20.12 55.16,47.9 v3(55.19,47.93)
  Bottom Layer w0.508: v3(49.05,52.92) 54.26,52.92 55.19,51.99 v3(55.19,47.93)
B: length 49.1
  Top Layer w0.381: CN18.2 19.33,53.77 18.45,54.66 ; 18.44,54.66 U17.28
C: length 49.6
  Top Layer w0.381: CN18.3 13.24,7.8 11.91,9.13 11.91,50.72 12.81,51.63 arc(13.36,51.99) U17.29
DS18B20: length 77.7
  Top Layer w0.381: v3(67.22,67.61) 67.22,77.65 68.36,78.79 70.52,78.79 U14.8
  Bottom Layer w0.381: v3(67.22,67.61) 67.22,19.36 61.63,13.77 CN20.2
DUOJI1: length 17.9
  Bottom Layer w0.508: U14.5 68.49,83.36 61.88,83.36 58.96,86.28 CN30.1
DUOJI2: length 14.3
  Bottom Layer w0.508: CN31.1 69.37,90.47 70.07,89.78 72.68,89.78 73.6,88.86 73.6,83.62 72.63,82.65 arc(72.58,82.61) 72.51,82.6 U14.6
DUOJI_5V: length 20.9
  Top Layer w0.762: CN31.2 71.92,90.35 arc(71.93,90.28) 71.97,90.22 ; 71.97,90.22 62.13,90.22 61.44,90.92 61.44,92.22 arc(61.45,92.31) CN30.2 ; 71.97,90.22 74.35,90.22 76.49,88.08 C1opt2.2
KEY1: length 42
  Top Layer w0.381: CN25.1 32.42,29.39 28.86,32.94 v3(21.88,32.94)
  Bottom Layer w0.381: U17.45 15.14,32.94 v3(21.88,32.94)
KEY2: length 35.8
  Top Layer w0.381: v3(21.88,31.8) 27.34,31.8 29.88,29.26 CN25.2
  Bottom Layer w0.381: U17.46 v3(21.88,31.8)
KEY3: length 35.6
  Top Layer w0.381: v3(22,30.34) 26,30.34 27.34,29.01 27.34,7.8
  Bottom Layer w0.381: U17.47 15.14,30.4 22,30.4
PWMA: length 36.1
  Top Layer w0.381: U14.29 61.75,52.12 55.47,58.41 46.45,58.41 42.42,54.38 42.42,51.74 41.61,50.93 40.46,50.93 arc(40.4,50.94) U20.23
PWMB: length 38.6
  Top Layer w0.381: U20.15 42.9,56.17 46.56,59.49 63.53,59.49 64.61,60.57 64.61,64.88 65.82,66.09 70.64,66.09 71.7,67.14 arc(71.76,67.24) U14.18
UART0-RX: length 136.8
  Bottom Layer w0.381: H7.1 4.1,9.83 4.48,9.45 18.07,9.45 24.8,16.18 24.8,68.25 26.16,69.61 66.96,69.61 67.9,68.68 arc(67.95,68.64) 68.01,68.63 73.31,68.63 74.2,69.52 74.2,72.69 73.25,73.65 70.39,73.65 69.29,72.55 arc(69.26,72.5) U14.13
UART0-TX: length 163.9
  Bottom Layer w0.381: 6.64,89.08 6.64,91.11 CN21.2 arc(6.51,91.24) 6.51,91.23 ; 6.64,89.08 19.46,89.08 20.16,88.38 20.16,71.55 arc(20.17,71.49) 20.21,71.44 21.11,70.54 67.34,70.54 67.85,71.04 70.77,71.04 71.52,71.79 arc(71.72,72.09) U14.14 ; 6.64,89.08 H7.2
UART1_RX: length 6937
  Bottom Layer w0.381: CN2.3 26.72,75.87 29.01,73.58 66.75,73.58 68.07,74.97 68.36,74.98 arc(68.47,2264.35) 68.57,74.98 U14.11
UART1_TX: length 58.8
  Bottom Layer w0.381: U14.12 70.58,76.19 64.17,76.19 62.36,74.38 46.01,74.38 43.74,76.65 29.99,76.65 29.24,77.39 29.24,91.06 arc(29.24,91.09) CN2.2
$1N2977: length 2.1
  Top Layer w1: LED2.1 74.84,12.39 arc(74.83,12.38) R4.2
$1N10381: length 8.5
  Top Layer w0.508: v1(88.04,59.73) 89.32,59.73 C5.2 ; v1(88.04,65.67) 87.98,65.73 R5.2
  Bottom Layer w0.508: v1(88.04,65.67) v1(88.04,59.73)
$1N11085: length 9.1
  Top Layer w0.508: 85.43,80.77 84.13,80.77 v1(84.13,80.78) ; C9.2 82.92,87.3 v1(84.11,87.3)
  Bottom Layer w0.508: v1(84.11,87.3) 84.11,80.8 v1(84.13,80.78)
$1N43238: length 7.1
  Bottom Layer w0.508: XL4016E1.4 84.04,94.61 arc(84.04,94.61) 84.04,94.6 84.74,93.9 89.06,93.9 arc(89.12,93.92) 89.17,93.95 105_0603.2
$1N43241: length 42.4
  Bottom Layer w0.508: XL4016E1.2 arc(80.6,95.53) 80.6,95.51 80.6,93.48 74.8,87.68 74.8,82.63 73.44,81.27 67.79,81.27 66.58,82.47 62k.1 arc(59.18,81.76) 58.78,81.15 58.45,80.82 33nf.1 54.32,76.37 arc(54.33,76.34) 10k.2
$1N43244: length 32.7
  Bottom Layer w0.508: 55.4,93.02 55.4,96.57 56.67,97.84 81.31,97.84 82.33,96.83 XL4016E1.3

## Copper pours and planes (outline as drawn; the poured copper is in the pictures)
3.3V on Bottom Layer: 75.34,74.96 77.76,74.96 77.76,68.29 75.34,68.29
5V on Top Layer: 76.05,64.06 84.04,64.06 84.04,58.47 76.05,58.47
5V on Top Layer: 81.44,60.8 95.16,60.8 95.16,55.17 81.44,55.17
5V on Bottom Layer: 81.18,71.27 87.48,71.27 87.48,68.75 81.18,68.75
5V on Bottom Layer: 76.31,68.89 84.61,68.89 84.61,58.34 76.31,58.34
5V on 5V: 0.26,99.74 97.74,99.74 97.74,0.26 0.26,0.26
9V on Top Layer: 38.51,59.24 41.43,59.24 41.43,57.45 38.51,57.45
9V on Top Layer: 39.28,63.11 41.4,63.11 41.4,57.45 39.28,57.45
9V on Bottom Layer: 42.19,83 57.87,83 57.87,79.26 42.19,79.26
12V on Top Layer: 88.81,69.9 90.71,69.9 90.71,63.3 88.81,63.3
12V on Top Layer: 81.69,83.47 83.47,83.47 83.47,77.21 81.69,77.21
12V on Top Layer: 89.47,80.05 95.44,80.05 95.44,68.38 89.47,68.38
12V on Top Layer: 82.44,80.63 91.38,80.63 91.38,76.45 82.44,76.45
12V on Top Layer: 86.19,68.04 90.58,68.04 90.58,66.09 86.19,66.09
12V on Top Layer: 85,96.7 96.3,96.7 96.3,79.17 85,79.17
12V on Bottom Layer: 85,96.28 92.68,96.28 92.68,94.79 85,94.79
12V on Bottom Layer: 81.55,93.27 96.28,93.27 96.28,77 81.55,77
GND on Top Layer: 90.58,69.77 92.36,69.77 92.36,63.63 90.58,63.63
GND on Top Layer: 79.79,84.12 81.47,84.12 81.47,83.11 79.79,83.11
GND on Top Layer: 91.11,75.58 95.44,75.58 95.44,66.81 91.11,66.81
GND on Top Layer: 46.48,56.17 48.95,56.17 48.95,55.52 46.48,55.52
GND on Top Layer: 46.45,52.27 49.06,52.27 49.06,51.62 46.45,51.62
GND on Top Layer: 89.84,61.01 91.4,61.01 91.4,56.68 89.84,56.68
GND on Top Layer: 79.91,90.12 82.07,90.12 82.07,77.22 79.91,77.22
GND on Top Layer: 90.34,64.06 95.79,64.06 95.79,61.01 90.34,61.01
GND on Top Layer: 76.87,83.49 81.69,83.49 81.69,82.38 76.87,82.38
GND on Bottom Layer: -23.72,111.05 135.16,111.05 135.16,-24.33 -23.72,-24.33
GND on GND: 0.26,99.74 97.74,99.74 97.74,0.26 0.26,0.26
DUOJI_5V on Top Layer: 76.85,91.87 91.09,91.87 91.09,85.91 76.85,85.91
$1N10374 on Top Layer: 91.25,62.24 95.79,62.24 95.79,59.46 91.25,59.46
$1N10379 on Top Layer: 81.31,65 90.07,65 90.07,62.63 81.31,62.63
$1N10381 on Top Layer: 88.93,61.77 90.04,61.77 90.04,59.14 88.93,59.14
$1N10383 on Top Layer: 86.57,62.38 90.07,62.38 90.07,61.23 86.57,61.23
$1N10384 on Top Layer: 91.25,62.41 94.25,62.41 94.25,61.48 91.25,61.48
$1N11084 on Top Layer: 78.37,84.97 81.03,84.97 81.03,84.25 78.37,84.25
$1N11085 on Top Layer: 82.33,87.94 83.6,87.94 83.6,85.1 82.33,85.1
$1N11090 on Top Layer: 82.33,84.12 85.98,84.12 85.98,82.17 82.33,82.17
$1N11090 on Top Layer: 84.56,83.84 92.29,83.84 92.29,81.84 84.56,81.84
$1N11091 on Top Layer: 82.33,85.01 85.98,85.01 85.98,83.86 82.33,83.86
$1N11095 on Top Layer: 76.9,87.14 81.06,87.14 81.06,84.25 76.9,84.25
$1N43244 on Bottom Layer: 47.66,95.3 56.98,95.3 56.98,89.08 47.66,89.08

Small or netless copper shapes (teardrops, artwork), in the pictures only: 88 on Top Layer, 59 on Bottom Layer, 142 on GND, 16 on 5V

## Text on the board
Bottom Silkscreen Layer: gnd / duoji5v | key 1 key2 key3 | 3.3 gnd | ao2 3.3v a b gnd ao1
Top Layer: 5V U0 GND | 3 2 1 | C B A | GND U1RX U1TX 5V | key 3 2 1 | GND 3.3V ADC2 | GND 3.3V ADC1 | DUOJI1 5V GND | GND DS 3.3V | DUOJI2 5V GND | AO1        AO2 | 3.3V GND | 12V
Top Silkscreen Layer: 5v
